# Altium schematic sheet rj50.SchDoc
size A4
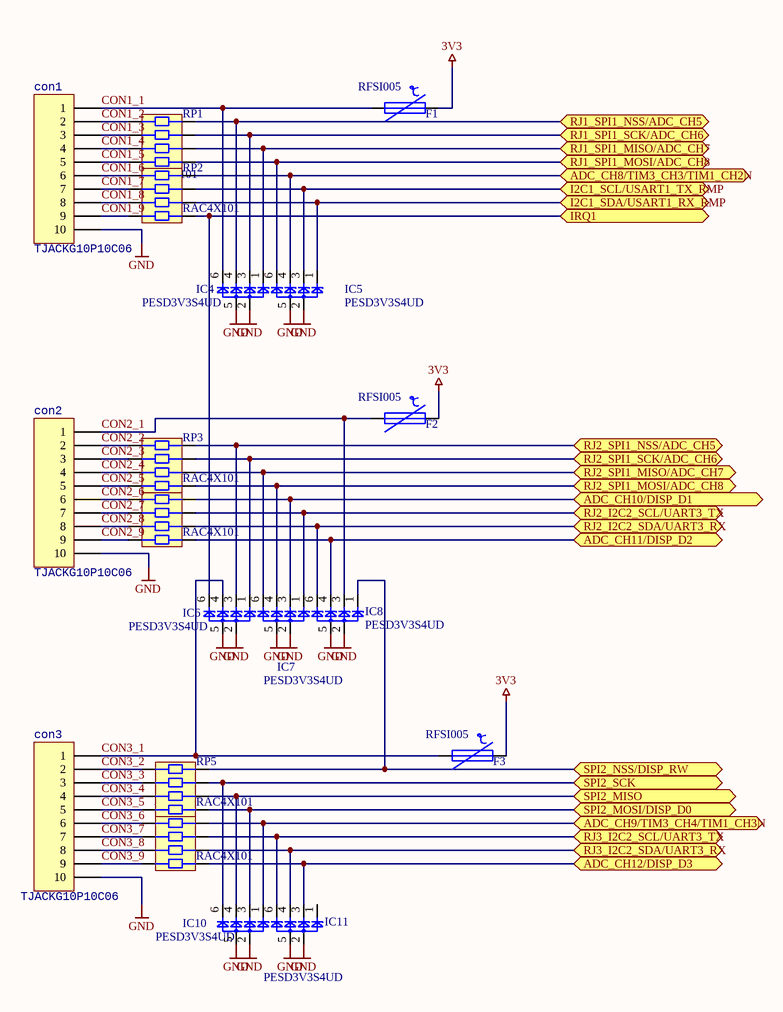
[diagram p0: rj50.SchDoc]

## Parts
con1  TJACKG10P10C06  [TJACKM10P10C03Y-LF]
con2  TJACKG10P10C06  [TJACKM10P10C03Y-LF]
con3  TJACKG10P10C06  [TJACKM10P10C03Y-LF]
F1  RFSI005  [0805R]
F2  RFSI005  [0805R]
F3  RFSI005  [0805R]
IC4  PESD3V3S4UD  [SOT23-6]
IC5  PESD3V3S4UD  [SOT23-6]
IC6  PESD3V3S4UD  [SOT23-6]
IC7  PESD3V3S4UD  [SOT23-6]
IC8  PESD3V3S4UD  [SOT23-6]
IC10  PESD3V3S4UD  [SOT23-6]
IC11  PESD3V3S4UD  [SOT23-6]
RP1  RAC4X101  [CAY-16]
RP2  RAC4X101  [CAY-16]
RP3  RAC4X101  [CAY-16]
RP4  RAC4X101  [CAY-16]
RP5  RAC4X101  [CAY-16]
RP6  RAC4X101  [CAY-16]

## Ports
ADC_CH8/TIM3_CH3/TIM1_CH2N, ADC_CH9/TIM3_CH4/TIM1_CH3N, ADC_CH10/DISP_D1, ADC_CH11/DISP_D2, ADC_CH12/DISP_D3, I2C1_SCL/USART1_TX_RMP, I2C1_SDA/USART1_RX_RMP, IRQ1, RJ1_SPI1_MISO/ADC_CH7, RJ1_SPI1_MOSI/ADC_CH8, RJ1_SPI1_NSS/ADC_CH5, RJ1_SPI1_SCK/ADC_CH6, RJ2_I2C2_SCL/UART3_TX, RJ2_I2C2_SDA/UART3_RX, RJ2_SPI1_MISO/ADC_CH7, RJ2_SPI1_MOSI/ADC_CH8, RJ2_SPI1_NSS/ADC_CH5, RJ2_SPI1_SCK/ADC_CH6, RJ3_I2C2_SCL/UART3_TX, RJ3_I2C2_SDA/UART3_RX, SPI2_MISO, SPI2_MOSI/DISP_D0, SPI2_NSS/DISP_RW, SPI2_SCK

## Nets
3V3: F1.2 F2.2 F3.2
GND: con1.10 con2.10 con3.10 IC4.2 IC4.5 IC5.2 IC5.5 IC6.2 IC6.5 IC7.2 IC7.5 IC8.2 IC8.5 IC10.2 IC10.5 IC11.2 IC11.5
ADC_CH8/TIM3_CH3/TIM1_CH2N: IC5.4 RP2.8 ; port ADC_CH8/TIM3_CH3/TIM1_CH2N
ADC_CH9/TIM3_CH4/TIM1_CH3N: IC10.1 RP6.8 ; port ADC_CH9/TIM3_CH4/TIM1_CH3N
ADC_CH10/DISP_D1: IC7.3 RP4.8 ; port ADC_CH10/DISP_D1
ADC_CH11/DISP_D2: IC8.4 RP4.5 ; port ADC_CH11/DISP_D2
ADC_CH12/DISP_D3: IC11.3 RP6.5 ; port ADC_CH12/DISP_D3
CON1_1: con1.1 F1.1 IC4.6
CON1_2: con1.2 RP1.1
CON1_3: con1.3 RP1.2
CON1_4: con1.4 RP1.3
CON1_5: con1.5 RP1.4
CON1_6: con1.6 RP2.1
CON1_7: con1.7 RP2.2
CON1_8: con1.8 RP2.3
CON1_9: con1.9 RP2.4
CON2_1: con2.1 F2.1 IC8.3
CON2_2: con2.2 RP3.1
CON2_3: con2.3 RP3.2
CON2_4: con2.4 RP3.3
CON2_5: con2.5 RP3.4
CON2_6: con2.6 RP4.1
CON2_7: con2.7 RP4.2
CON2_8: con2.8 RP4.3
CON2_9: con2.9 RP4.4
CON3_1: con3.1 F3.1 IC6.4
CON3_2: con3.2 RP5.1
CON3_3: con3.3 RP5.2
CON3_4: con3.4 RP5.3
CON3_5: con3.5 RP5.4
CON3_6: con3.6 RP6.1
CON3_7: con3.7 RP6.2
CON3_8: con3.8 RP6.3
CON3_9: con3.9 RP6.4
I2C1_SCL/USART1_TX_RMP: IC5.3 RP2.7 ; port I2C1_SCL/USART1_TX_RMP
I2C1_SDA/USART1_RX_RMP: IC5.1 RP2.6 ; port I2C1_SDA/USART1_RX_RMP
IRQ1: IC6.6 RP2.5 ; port IRQ1
RJ1_SPI1_MISO/ADC_CH7: IC4.1 RP1.6 ; port RJ1_SPI1_MISO/ADC_CH7
RJ1_SPI1_MOSI/ADC_CH8: IC5.6 RP1.5 ; port RJ1_SPI1_MOSI/ADC_CH8
RJ1_SPI1_NSS/ADC_CH5: IC4.4 RP1.8 ; port RJ1_SPI1_NSS/ADC_CH5
RJ1_SPI1_SCK/ADC_CH6: IC4.3 RP1.7 ; port RJ1_SPI1_SCK/ADC_CH6
RJ2_I2C2_SCL/UART3_TX: IC7.1 RP4.7 ; port RJ2_I2C2_SCL/UART3_TX
RJ2_I2C2_SDA/UART3_RX: IC8.6 RP4.6 ; port RJ2_I2C2_SDA/UART3_RX
RJ2_SPI1_MISO/ADC_CH7: IC7.6 RP3.6 ; port RJ2_SPI1_MISO/ADC_CH7
RJ2_SPI1_MOSI/ADC_CH8: IC7.4 RP3.5 ; port RJ2_SPI1_MOSI/ADC_CH8
RJ2_SPI1_NSS/ADC_CH5: IC6.3 RP3.8 ; port RJ2_SPI1_NSS/ADC_CH5
RJ2_SPI1_SCK/ADC_CH6: IC6.1 RP3.7 ; port RJ2_SPI1_SCK/ADC_CH6
RJ3_I2C2_SCL/UART3_TX: IC11.6 RP6.7 ; port RJ3_I2C2_SCL/UART3_TX
RJ3_I2C2_SDA/UART3_RX: IC11.4 RP6.6 ; port RJ3_I2C2_SDA/UART3_RX
SPI2_MISO: IC10.4 RP5.6 ; port SPI2_MISO
SPI2_MOSI/DISP_D0: IC10.3 RP5.5 ; port SPI2_MOSI/DISP_D0
SPI2_NSS/DISP_RW: IC8.1 RP5.8 ; port SPI2_NSS/DISP_RW
SPI2_SCK: IC10.6 RP5.7 ; port SPI2_SCK

Not connected (* = marked no-connect by the designer): IC11 1

## Library data of the parts
con1-con3 = CON_RJ50: 10P10C Unshielded Connector (Maritex)
F1-F3 = F_PTC_0.1A: polymer FUSE Maritex
IC4-IC8 IC10 IC11 = D_TVS_BZA462A: Quadruple 4V ESD transient voltage suppressor
RP1-RP6 = RES_ARRAY_1206: Resistor network 1206 (4x0402) Maritex RAC4Xxxx